# EasyEDA Pro project Modular-Analog-Synthesizer.eprj, board VCO-PCB
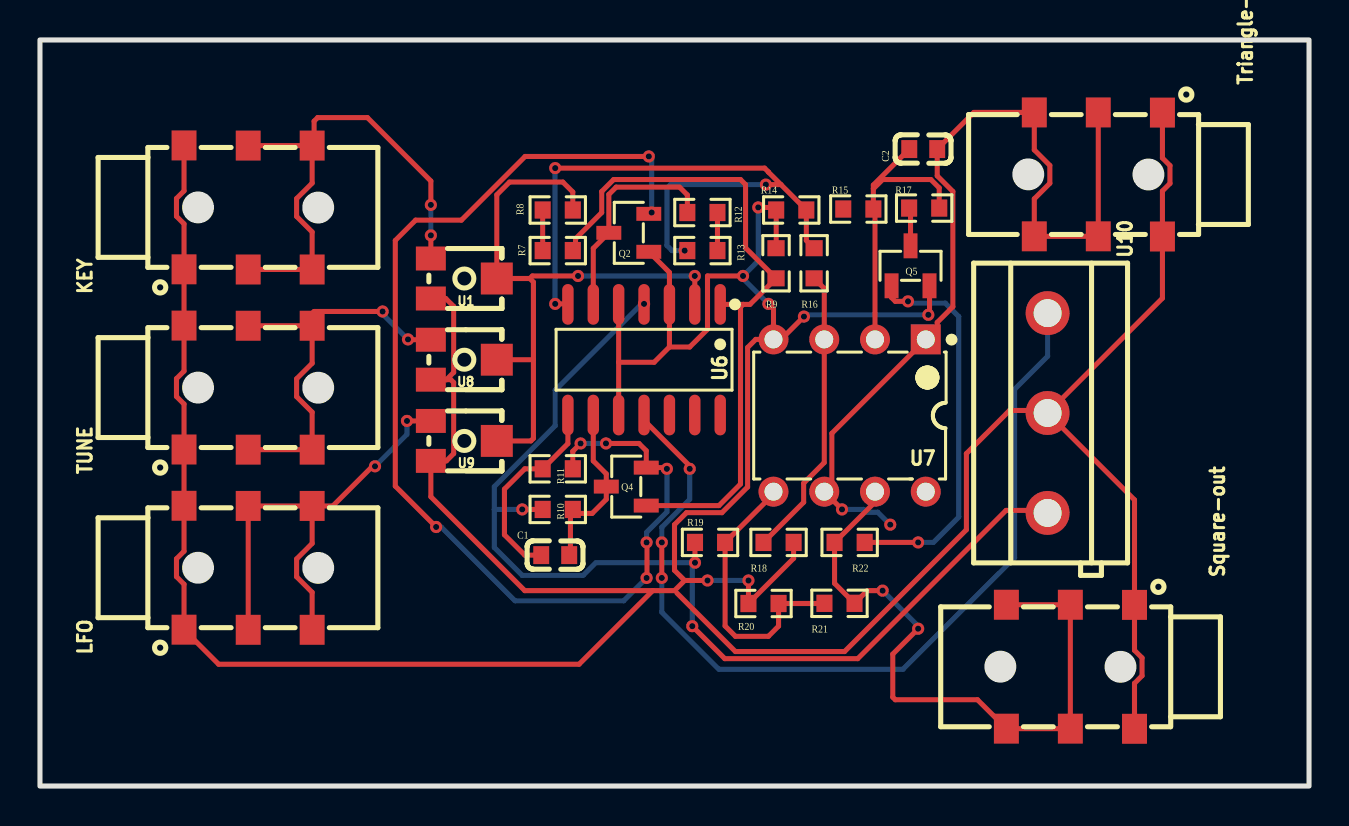
[diagram p7: board, top side]
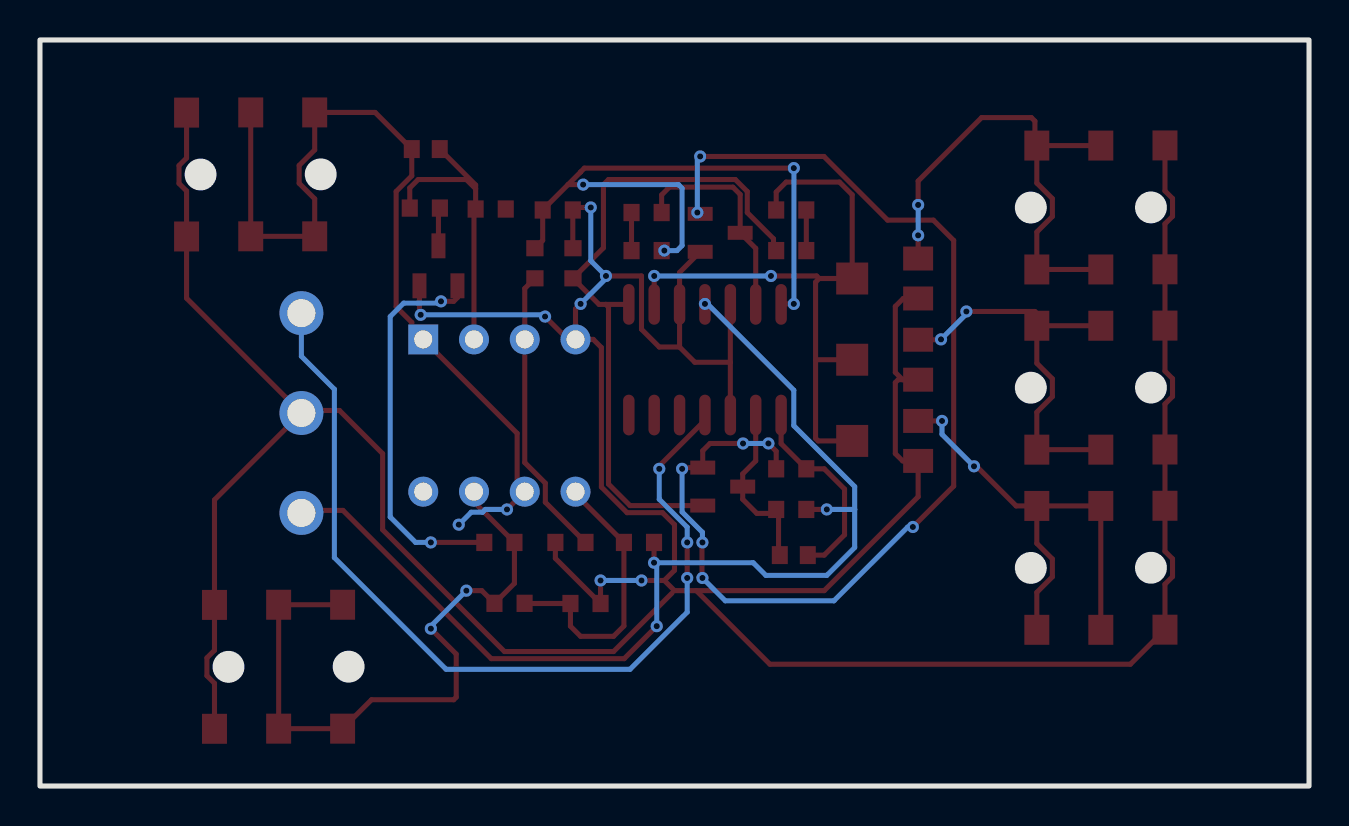
[diagram p8: board, bottom side, seen from below]

Outline 63.5 x 37.34 mm; copper layers: Top Layer, Bottom Layer. Coordinates in mm from the lower left corner of the outline.
Outline path: rectangle 0,37.34 63.5,0
Stack: Top Layer 0.035mm / Dielectric1 1.51mm FR4 er 4.5 / Bottom Layer 0.035mm

## Design rules (mm)
template: JLCPCB Capability(Two Layers Board)
spacing copperThickness1oz (default): track to track 0.102, other pairs 0.152 to 0.3
spacing copperThickness2oz: track to track 0.203, other pairs 0.152 to 0.3
track width copperThickness1oz (default): min 0.127, default 0.254, max 2.54
track width copperThickness2oz: min 0.203, default 0.254, max 2.54
differential pair differentialPair (default): width min 0.127, default 0.254, max 2.54; gap min 0.152, default 0.152
via viaSize (default): diameter min 0.5, default 0.61, max 10; hole min 0.3, default 0.305, max 6.3

## Placement (name value [footprint] x y rotation side)
C1  1n  [C0603]  25.78 11.56 0 top
C2  4.7n  [C0603]  44.2 31.88 0 top
KEY  -  [AUDIO-SMD_PJ-313D]  10.41 28.96 90 top
LFO  -  [AUDIO-SMD_PJ-313D]  10.41 10.92 90 top
Q2  -  [SOT-23-3_L2.9-W1.3-P1.90-LS2.4-BR]  29.46 27.69 0 top
Q4  -  [SOT-23-3_L2.9-W1.3-P1.90-LS2.4-BR]  29.34 14.99 0 top
Q5  -  [SOT-23-3_L2.9-W1.3-P1.90-LS2.4-BR]  43.56 26.03 270 top
R7  1k  [R0603]  25.91 28.83 180 top
R8  0.6k  [R0603]  25.91 26.8 0 top
R9  0.4k  [R0603]  36.83 26.16 270 top
R10  1Meg  [R0603]  25.91 13.84 180 top
R11  1k  [R0603]  25.91 15.88 0 top
R12  20k  [R0603]  33.15 28.7 0 top
R13  8k  [R0603]  33.15 26.8 180 top
R14  1k  [R0603]  37.59 28.83 0 top
R15  100k  [R0603]  40.95 28.88 0 top
R16  47k  [R0603]  38.73 26.16 270 top
R17  47k  [R0603]  44.24 28.92 0 top
R18  47k  [R0603]  36.96 12.19 180 top
R19  100k  [R0603]  33.53 12.19 0 top
R20  100k  [R0603]  36.2 9.14 0 top
R21  100k  [R0603]  40 9.14 0 top
R22  100k  [R0603]  40.51 12.19 180 top
Square-out  -  [AUDIO-SMD_PJ-313D]  51.56 5.97 270 top
Triangle-out  -  [AUDIO-SMD_PJ-313D]  52.96 30.61 270 top
TUNE  -  [AUDIO-SMD_PJ-313D]  10.41 19.94 90 top
U1  Pot-100k  [RES-ADJ-SMD_VG039NCH]  21.21 25.4 180 top
U6  -  [SOIC-14_L8.7-W3.9-P1.27-LS6.0-BL]  30.23 21.34 180 top
U7  -  [DIP-8_L9.6-W6.4-P2.54-LS7.6-BL-1]  40.51 18.54 180 top
U8  Pot-100k  [RES-ADJ-SMD_VG039NCH]  21.21 21.34 180 top
U9  Pot-100k  [RES-ADJ-SMD_VG039NCH]  21.21 17.27 180 top
U10  -  [CONN-TH_3P-P5.00_KF301-5.0-3P]  50.42 18.67 270 top

## Footprints (pads in the part's own frame, mm; a bottom-side part is the same pattern mirrored in y, then rotated)
AUDIO-SMD_PJ-313D
  rect 1.501x1.25 smd: 1(-3.096,3.205) 1(3.104,3.205) 2(-3.104,-3.205) 2(3.096,-3.205) 3(-3.104,-0.005) 3(3.096,-0.005)
C0603
  rect 0.8x0.9 smd: 1(-0.7,0) 2(0.7,0)
CONN-TH_3P-P5.00_KF301-5.0-3P
  round 2.2 hole 1.399: 1(-4.998,0) 2(0,0) 3(5.002,0)
DIP-8_L9.6-W6.4-P2.54-LS7.6-BL-1
  rect 1.501x1.501 hole 0.899: 1(-3.81,-3.81)
  round 1.501 hole 0.899: 2(-1.27,-3.81) 3(1.27,-3.81) 4(3.81,-3.81) 5(3.81,3.81) 6(1.27,3.81) 7(-1.27,3.81) 8(-3.81,3.81)
R0603
  rect 0.806x0.864 smd: 1(-0.753,0) 2(0.753,0)
RES-ADJ-SMD_VG039NCH
  rect 1.5x1.2 smd: 1(1.65,-1) 3(1.65,1)
  rect 1.6x1.6 smd: 2(-1.65,0)
SOIC-14_L8.7-W3.9-P1.27-LS6.0-BL
  oval 0.574x2.038 smd: 1(-3.81,-2.769) 2(-2.54,-2.769) 3(-1.27,-2.769) 4(0,-2.769) 5(1.27,-2.769) 6(2.54,-2.769) 7(3.81,-2.769) 8(3.81,2.769) 9(2.54,2.769) 10(1.27,2.769) 11(0,2.769) 12(-1.27,2.769) 13(-2.54,2.769) 14(-3.81,2.769)
SOT-23-3_L2.9-W1.3-P1.90-LS2.4-BR
  rect 1.25x0.7 smd: 1(1,-0.95) 2(1,0.95) 3(-1,0)

## Nets
As in the schematic.

Pads without a net: U6 12 13 14

## Via types
v1: diameter 0.61, hole 0.305, Top Layer to Bottom Layer, 40 vias

## Routing (per net, layer and track width the routed paths; a pad name or vN(x,y) marks a point on that pad's centre or on a via; arc(x,y) is an arc through that point)
GND: length 206.1
  Top Layer w0.254: U10.2 50.29,18.8 48.51,18.8 46.36,16.64 46.36,12.83 40.26,6.73 34.8,6.73 31.88,9.65 ; U10.2 54.77,14.32 Square-out.1 54.77,6.79 55.15,6.41 55.15,5.52 54.77,5.14 Square-out.1 ; U10.2 56.16,24.41 Triangle-out.1 56.16,29.78 56.54,30.16 56.54,31.05 56.16,31.43 Triangle-out.1 ; v1(44.45,23.58) 44.51,23.64 Q5.2 ; KEY.1 7.21,29.78 6.83,29.41 6.83,28.51 7.21,28.13 KEY.1 TUNE.1 7.21,20.77 6.83,20.39 6.83,19.49 7.21,19.12 TUNE.1 LFO.1 7.21,11.75 6.83,11.37 6.83,10.48 7.21,10.1 LFO.1 8.94,6.1 26.98,6.1 30.66,9.78 ; U6.10 28.96,21.21 ; 28.96,21.21 30.73,21.21 31.5,21.97 ; 28.96,21.21 U6.5 ; Q2.1 31.5,25.7 U6.3 31.5,21.97 ; U1.3 20.3,24.4 20.7,24 20.7,20.7 20.34,20.34 ; R18.1 37.71,11.4 R20.1 v1(35.45,10.29) ; 32.26,10.29 31.75,10.8 31.75,13.08 32.35,13.68 34.12,13.68 35.41,14.97 35.41,21.95 35.81,22.35 U7.4 ; 32.26,10.29 31.75,9.78 30.66,9.78 ; 32.26,10.29 v1(33.4,10.29) ; U8.3 20.34,20.34 ; 20.34,20.34 20.56,20.34 20.7,20.19 20.7,16.64 20.34,16.27 U9.3 19.56,14.48 24.26,9.78 30.66,9.78 ; R9.1 36.84,26.92 R14.1 36.71,28.96 v1(35.94,28.96) ; U7.4 36.7,23.88 v1(36.45,24.13) ; U7.4 37.08,22.35 v1(38.23,23.49) ; v1(35.18,25.53) 33.4,25.53 33.4,22.86 32.51,21.97 31.5,21.97
  Bottom Layer w0.254: v1(36.45,24.13) 35.18,25.4 v1(35.18,25.53) 35.94,26.29 v1(35.94,28.96) ; v1(44.45,23.58) 38.31,23.58 v1(38.23,23.49) ; v1(35.45,10.29) v1(33.4,10.29)
VCC: length 54.5
  Top Layer w0.254: U10.3 50.29,13.79 48.34,13.79 40.92,6.38 34.27,6.38 v1(32.64,8) ; R10.2 v1(24.13,13.84) ; R19.1 v1(32.77,11.18)
  Bottom Layer w0.254: v1(32.64,8) 32.64,11.04 v1(32.77,11.18) 27.81,11.18 27.18,10.54 24.13,10.54 22.73,11.94 22.73,13.84 ; v1(30.23,24.13) 30.1,24.13 25.78,19.81 25.78,18.03 22.73,14.99 22.73,13.84 ; 22.73,13.84 v1(24.13,13.84)
VEE: length 45.5
  Top Layer w0.254: v1(32.51,15.88) 32.51,16.02 30.23,18.3 U6.11 ; v1(31.11,12.19) v1(31.11,10.41)
  Bottom Layer w0.254: v1(32.51,15.88) 32.51,14.35 31.11,12.95 v1(31.11,12.19) ; U10.1 50.42,21.51 48.77,19.86 48.77,11.43 43.18,5.84 33.97,5.84 31.11,8.7 v1(31.11,10.41)
$1N908: length 32.5
  Top Layer w0.254: 24.69,21.34 24.69,17.4 24.56,17.27 U9.2 ; 24.69,21.34 U8.2 ; 24.69,21.34 24.69,25.22 24.51,25.4 ; 24.51,25.4 24.64,25.53 v1(26.92,25.53) ; 24.51,25.4 U1.2 22.86,29.59 23.49,30.23 26.16,30.23 26.66,29.73 R7.1 ; U6.2 v1(32.77,25.53)
  Bottom Layer w0.254: v1(32.77,25.53) v1(26.92,25.53)
$1N1390: length 2
  Top Layer w0.254: R8.1 R7.2
$1N1601: length 9
  Top Layer w0.254: 26.54,13.84 26.54,11.62 C1.2 ; R10.1 26.66,13.64 27.63,13.64 28.34,14.35 Q4.3 28.34,15.62 27.69,16.27 U6.9
$1N1617: length 57.7
  Top Layer w0.254: v1(19.82,12.97) 17.78,15.01 17.78,27.3 18.8,28.32 21.09,28.32 24.27,31.51 v1(30.46,31.51) ; v1(28.32,17.14) 29.97,17.14 30.34,16.78 Q4.2 31.31,15.94 v1(31.37,15.88) ; R11.2 26.66,16.76 v1(27.05,17.14) ; v1(30.35,12.19) 30.37,12.17 30.37,10.44 v1(30.35,10.41)
  Bottom Layer w0.254: v1(31.37,15.88) 31.37,13.72 30.35,12.7 v1(30.35,12.19) ; v1(19.82,12.97) 20.08,12.97 23.77,9.27 29.21,9.27 v1(30.35,10.41) ; v1(28.32,17.14) v1(27.05,17.14) ; v1(30.61,28.7) 30.61,31.37 v1(30.46,31.51)
$1N1710: length 10.1
  Top Layer w0.254: C1.1 24.26,11.56 23.24,12.57 23.24,14.86 24.26,15.88 R11.1 26.42,17.14 U6.8
$1N1876: length 10.9
  Top Layer w0.254: U6.6 27.69,26.91 Q2.3 28.46,29.61 28.83,29.97 32,29.97 32.39,29.58 R12.1
$1N2057: length 1.9
  Top Layer w0.254: R12.2 R13.1
$1N2452: length 15
  Top Layer w0.254: 41.7,29.89 R15.2 41.78,28.79 U7.2 ; 41.7,29.89 41.7,30.08 C2.1 ; 41.7,29.89 42.16,30.35 44.58,30.35 45,29.93 R17.2
$1N2464: length 1.9
  Top Layer w0.254: Q5.3 43.56,28.85 R17.1
$1N2551: length 14.7
  Top Layer w0.254: R16.2 39.24,24.9 U7.3 39.24,16.19 38.21,15.16 38.21,14.2 R18.2
$1N2709: length 46
  Top Layer w0.254: Triangle-out.3 Triangle-out.3 Triangle-out.2 49.75,29.39 50.53,30.16 50.53,31.06 49.75,31.84 Triangle-out.2 46.73,33.71 C2.2 44.9,30.54 45.68,29.75 45.68,23.99 44.9,23.2 44.9,22.92 U7.1 39.62,17.65 39.62,15.24 39.24,14.86 U7.6 v1(40.13,13.84)
  Bottom Layer w0.254: v1(42.55,13.08) 41.92,13.7 41.36,13.7 41.22,13.84 v1(40.13,13.84)
$1N2952: length 14.3
  Top Layer w0.254: U7.5 36.7,14.61 R19.2 34.28,8.01 34.8,7.49 36.45,7.49 36.96,8 R20.2 39.24,9.14 R21.1
$1N2993: length 19.6
  Top Layer w0.254: v1(43.43,24.26) 42.8,24.26 42.61,24.44 Q5.1 ; R22.1 v1(43.94,12.19)
  Bottom Layer w0.254: v1(43.94,12.19) 44.7,12.19 45.97,13.46 45.97,23.49 45.3,24.17 43.52,24.17 v1(43.43,24.26)
$1N3031: length 34
  Top Layer w0.254: v1(43.94,7.87) 42.67,6.6 42.67,4.44 42.8,4.32 46.91,4.32 Square-out.2 Square-out.3 Square-out.3 Square-out.2 ; v1(42.16,9.78) 41.39,9.78 R21.2 39.76,10.14 R22.2 41.78,14.22 U7.7
  Bottom Layer w0.254: v1(42.16,9.78) 43.94,8 v1(43.94,7.87)
$1N4427: length 34
  Top Layer w0.254: Q4.1 33.98,14.04 35.05,15.11 35.05,23.97 35.19,24.11 ; R8.2 26.8,26.93 26.8,27.39 28.11,28.7 28.11,29.75 28.71,30.35 35.05,30.35 35.31,30.1 35.31,26.93 R9.2 35.53,24.11 35.19,24.11 ; 35.19,24.11 U6.1
$1N4457: length 34.5
  Top Layer w0.254: 31.74,30.35 33.54,30.35 ; v1(25.78,24.13) 26.39,24.13 U6.7 ; 40.15,28.83 R15.1 ; 37.08,30.1 36.45,30.73 36.45,30.73 36.26,30.92 v1(25.78,30.92) ; 37.08,30.1 v1(36.32,30.1) ; 37.08,30.1 R14.2 38.35,27.3 R16.1
  Bottom Layer w0.254: v1(25.78,24.13) 25.77,24.14 25.77,30.92 v1(25.78,30.92) ; v1(36.32,30.1) 31.55,30.1 31.37,29.92 31.37,27.05 31.62,26.8 v1(32.26,26.8)
$1N5698: length 20.5
  Top Layer w0.254: TUNE.2 13.62,23.65 13.72,23.75 v1(17.14,23.75) ; TUNE.2 TUNE.3 ; TUNE.2 13.62,21.16 12.84,20.38 12.84,19.49 13.62,18.71 TUNE.2 TUNE.3 ; U8.1 18.43,22.34 v1(18.42,22.35)
  Bottom Layer w0.254: v1(17.14,23.75) 17.14,23.62 v1(18.42,22.35)
$1N5746: length 24.4
  Top Layer w0.254: LFO.3 LFO.3 LFO.2 ; LFO.2 14.65,14.02 16.76,16.13 ; LFO.2 13.62,12.14 12.84,11.36 12.84,10.47 13.62,9.69 LFO.2 ; U9.1 v1(18.36,18.27)
  Bottom Layer w0.254: v1(18.36,18.27) 18.36,17.6 v1(16.76,16)
$1N5794: length 25.6
  Top Layer w0.254: KEY.2 13.72,32.15 13.72,33.27 13.9,33.45 16.38,33.45 19.56,30.28 v1(19.56,29.08) ; KEY.2 KEY.3 ; KEY.2 13.62,30.17 12.84,29.4 12.84,28.5 13.62,27.73 KEY.2 KEY.3 ; U1.1 v1(19.56,27.56)
  Bottom Layer w0.254: v1(19.56,27.56) v1(19.56,29.08)
